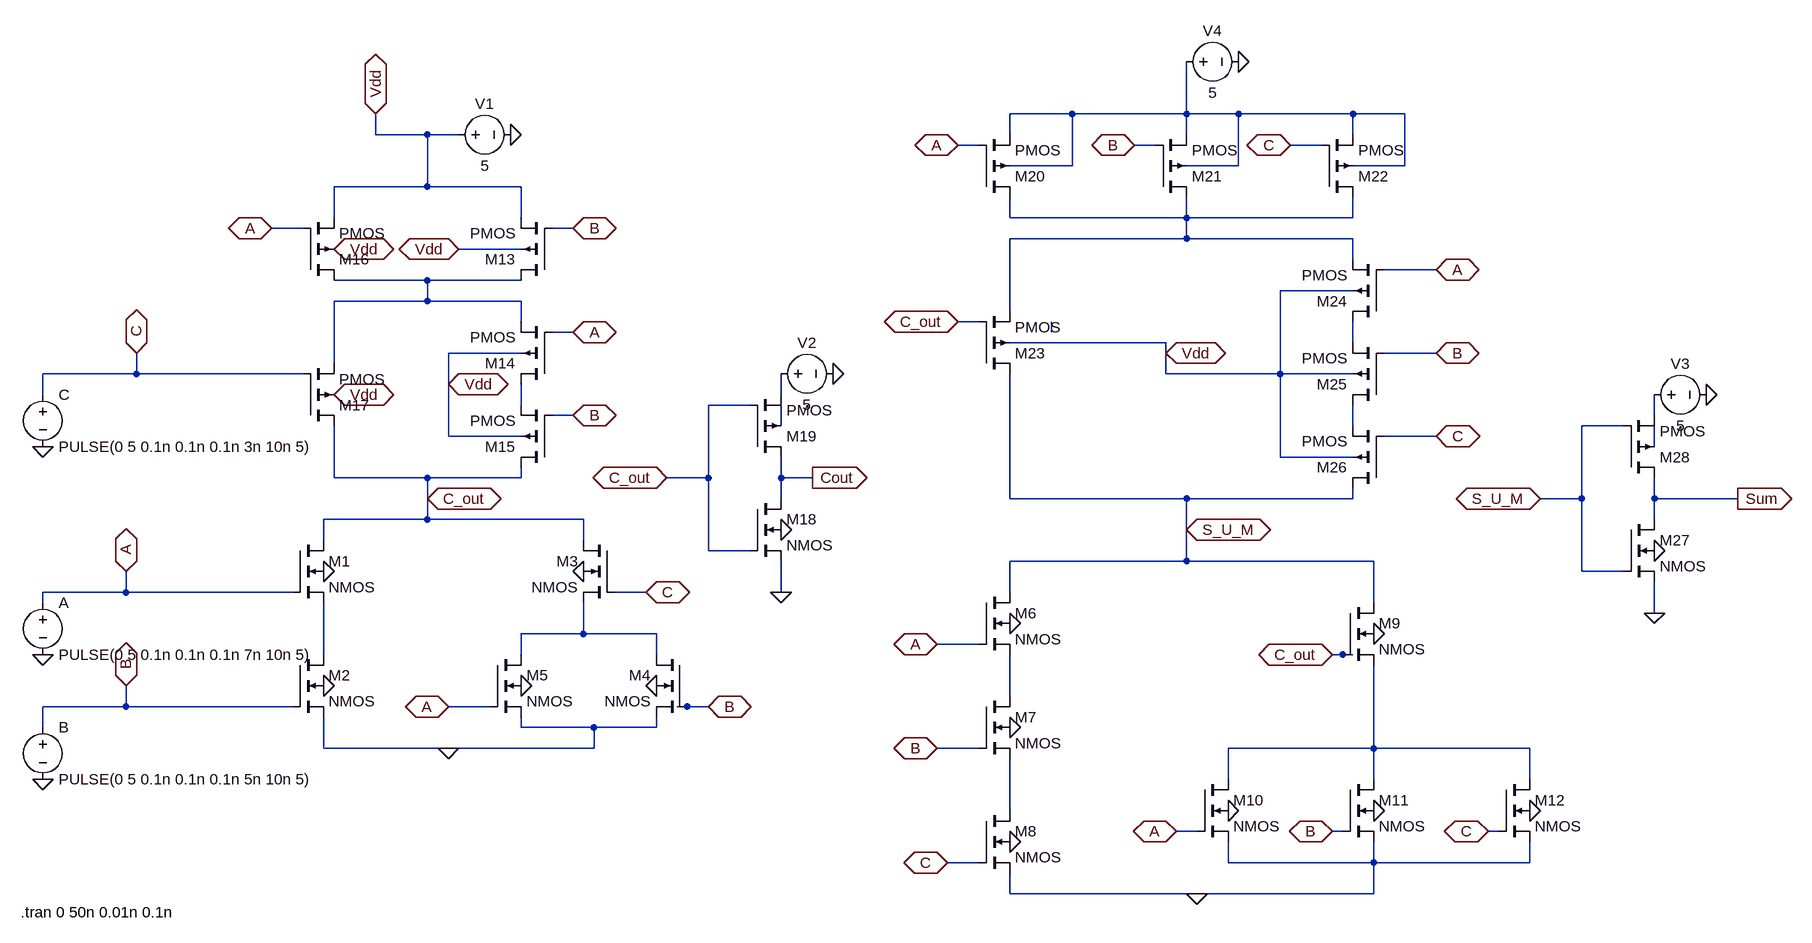
[diagram p0: schematic fulladder.asc]
fulladder.asc, the LTspice schematic file:
Version 4
SHEET 1 880 680
WIRE -2080 -1840 -2176 -1840
WIRE -1904 -1840 -1904 -1920
WIRE -1904 -1840 -2080 -1840
WIRE -1824 -1840 -1904 -1840
WIRE -1648 -1840 -1824 -1840
WIRE -1568 -1840 -1648 -1840
WIRE -3152 -1808 -3152 -1840
WIRE -3072 -1808 -3152 -1808
WIRE -3024 -1808 -3072 -1808
WIRE -2176 -1808 -2176 -1840
WIRE -1904 -1808 -1904 -1840
WIRE -1648 -1808 -1648 -1840
WIRE -2224 -1792 -2256 -1792
WIRE -1952 -1792 -1984 -1792
WIRE -1696 -1792 -1744 -1792
WIRE -2080 -1760 -2080 -1840
WIRE -2080 -1760 -2176 -1760
WIRE -1824 -1760 -1824 -1840
WIRE -1824 -1760 -1904 -1760
WIRE -1568 -1760 -1568 -1840
WIRE -1568 -1760 -1648 -1760
WIRE -3072 -1728 -3072 -1808
WIRE -3072 -1728 -3216 -1728
WIRE -2928 -1728 -3072 -1728
WIRE -3216 -1680 -3216 -1728
WIRE -2928 -1680 -2928 -1728
WIRE -2176 -1680 -2176 -1712
WIRE -1904 -1680 -1904 -1712
WIRE -1904 -1680 -2176 -1680
WIRE -1648 -1680 -1648 -1712
WIRE -1648 -1680 -1904 -1680
WIRE -3264 -1664 -3312 -1664
WIRE -2848 -1664 -2880 -1664
WIRE -1904 -1648 -1904 -1680
WIRE -1904 -1648 -2176 -1648
WIRE -1648 -1648 -1904 -1648
WIRE -2928 -1632 -3024 -1632
WIRE -1648 -1616 -1648 -1648
WIRE -1520 -1600 -1600 -1600
WIRE -3072 -1584 -3216 -1584
WIRE -2928 -1584 -3072 -1584
WIRE -1648 -1568 -1760 -1568
WIRE -3072 -1552 -3072 -1584
WIRE -3072 -1552 -3216 -1552
WIRE -2928 -1552 -3072 -1552
WIRE -2176 -1536 -2176 -1648
WIRE -2928 -1520 -2928 -1552
WIRE -2224 -1520 -2256 -1520
WIRE -2848 -1504 -2880 -1504
WIRE -2112 -1504 -2112 -1520
WIRE -1936 -1488 -2176 -1488
WIRE -1648 -1488 -1648 -1520
WIRE -2928 -1472 -3040 -1472
WIRE -1936 -1472 -1936 -1488
WIRE -1520 -1472 -1600 -1472
WIRE -3216 -1456 -3216 -1552
WIRE -3520 -1440 -3520 -1472
WIRE -3520 -1440 -3664 -1440
WIRE -3264 -1440 -3520 -1440
WIRE -1936 -1440 -1936 -1472
WIRE -1760 -1440 -1760 -1568
WIRE -1760 -1440 -1936 -1440
WIRE -1648 -1440 -1760 -1440
WIRE -3040 -1424 -3040 -1472
WIRE -3664 -1408 -3664 -1440
WIRE -2528 -1408 -2528 -1440
WIRE -2928 -1392 -2928 -1424
WIRE -2576 -1392 -2640 -1392
WIRE -2848 -1376 -2880 -1376
WIRE -1184 -1376 -1184 -1408
WIRE -2528 -1360 -2528 -1392
WIRE -1648 -1360 -1648 -1392
WIRE -1232 -1360 -1296 -1360
WIRE -3040 -1344 -3040 -1424
WIRE -2928 -1344 -3040 -1344
WIRE -1520 -1344 -1600 -1344
WIRE -1184 -1328 -1184 -1360
WIRE -1760 -1312 -1760 -1440
WIRE -1648 -1312 -1760 -1312
WIRE -3216 -1280 -3216 -1360
WIRE -3072 -1280 -3216 -1280
WIRE -2928 -1280 -2928 -1296
WIRE -2928 -1280 -3072 -1280
WIRE -2640 -1280 -2640 -1392
WIRE -2640 -1280 -2704 -1280
WIRE -2528 -1280 -2528 -1312
WIRE -2480 -1280 -2528 -1280
WIRE -3072 -1248 -3072 -1280
WIRE -2528 -1248 -2528 -1280
WIRE -2176 -1248 -2176 -1440
WIRE -1904 -1248 -2176 -1248
WIRE -1648 -1248 -1648 -1264
WIRE -1648 -1248 -1904 -1248
WIRE -1296 -1248 -1296 -1360
WIRE -1296 -1248 -1360 -1248
WIRE -1184 -1248 -1184 -1280
WIRE -1056 -1248 -1184 -1248
WIRE -3072 -1216 -3072 -1248
WIRE -3072 -1216 -3232 -1216
WIRE -2832 -1216 -3072 -1216
WIRE -1184 -1216 -1184 -1248
WIRE -1904 -1200 -1904 -1248
WIRE -3232 -1184 -3232 -1216
WIRE -2832 -1184 -2832 -1216
WIRE -2640 -1168 -2640 -1280
WIRE -2576 -1168 -2640 -1168
WIRE -1904 -1152 -1904 -1200
WIRE -1904 -1152 -2176 -1152
WIRE -1616 -1152 -1904 -1152
WIRE -1296 -1136 -1296 -1248
WIRE -1232 -1136 -1296 -1136
WIRE -3536 -1104 -3536 -1136
WIRE -3536 -1104 -3664 -1104
WIRE -3280 -1104 -3536 -1104
WIRE -2736 -1104 -2784 -1104
WIRE -2528 -1104 -2528 -1152
WIRE -2176 -1104 -2176 -1152
WIRE -3664 -1088 -3664 -1104
WIRE -1616 -1088 -1616 -1152
WIRE -1184 -1072 -1184 -1120
WIRE -2832 -1040 -2832 -1088
WIRE -2832 -1040 -2928 -1040
WIRE -2720 -1040 -2832 -1040
WIRE -2224 -1024 -2288 -1024
WIRE -3232 -1008 -3232 -1088
WIRE -2928 -1008 -2928 -1040
WIRE -2720 -1008 -2720 -1040
WIRE -1664 -1008 -1680 -1008
WIRE -1648 -1008 -1664 -1008
WIRE -2176 -944 -2176 -1008
WIRE -3536 -928 -3536 -960
WIRE -3536 -928 -3664 -928
WIRE -3280 -928 -3536 -928
WIRE -2976 -928 -3040 -928
WIRE -2672 -928 -2688 -928
WIRE -2640 -928 -2672 -928
WIRE -3664 -896 -3664 -928
WIRE -2928 -896 -2928 -912
WIRE -2816 -896 -2928 -896
WIRE -2720 -896 -2720 -912
WIRE -2720 -896 -2816 -896
WIRE -3232 -864 -3232 -912
WIRE -3040 -864 -3232 -864
WIRE -2816 -864 -2816 -896
WIRE -2816 -864 -3040 -864
WIRE -2224 -864 -2288 -864
WIRE -1616 -864 -1616 -992
WIRE -1616 -864 -1840 -864
WIRE -1376 -864 -1616 -864
WIRE -1840 -816 -1840 -864
WIRE -1616 -816 -1616 -864
WIRE -1376 -816 -1376 -864
WIRE -2176 -768 -2176 -848
WIRE -1888 -736 -1920 -736
WIRE -1664 -736 -1680 -736
WIRE -1424 -736 -1440 -736
WIRE -2224 -688 -2272 -688
WIRE -1840 -688 -1840 -720
WIRE -1616 -688 -1616 -720
WIRE -1616 -688 -1840 -688
WIRE -1376 -688 -1376 -720
WIRE -1376 -688 -1616 -688
WIRE -2176 -640 -2176 -672
WIRE -1888 -640 -2176 -640
WIRE -1616 -640 -1616 -688
WIRE -1616 -640 -1888 -640
FLAG -3664 -1328 0
FLAG -3664 -1008 0
FLAG -3664 -816 0
FLAG -3232 -1136 0
FLAG -3232 -960 0
FLAG -2928 -960 0
FLAG -2720 -960 0
FLAG -2832 -1136 0
FLAG -2944 -1808 0
FLAG -3152 -1840 Vdd
IOPIN -3152 -1840 BiDir
FLAG -3216 -1632 Vdd
IOPIN -3216 -1632 BiDir
FLAG -3216 -1408 Vdd
IOPIN -3216 -1408 BiDir
FLAG -3024 -1632 Vdd
IOPIN -3024 -1632 BiDir
FLAG -3040 -1424 Vdd
IOPIN -3040 -1424 BiDir
FLAG -3536 -1136 A
IOPIN -3536 -1136 BiDir
FLAG -3040 -928 A
IOPIN -3040 -928 BiDir
FLAG -2848 -1504 A
IOPIN -2848 -1504 BiDir
FLAG -3312 -1664 A
IOPIN -3312 -1664 BiDir
FLAG -2848 -1376 B
IOPIN -2848 -1376 BiDir
FLAG -2848 -1664 B
IOPIN -2848 -1664 BiDir
FLAG -2736 -1104 C
IOPIN -2736 -1104 BiDir
FLAG -2640 -928 B
IOPIN -2640 -928 BiDir
FLAG -3536 -960 B
IOPIN -3536 -960 BiDir
FLAG -3520 -1472 C
IOPIN -3520 -1472 BiDir
FLAG -1440 -736 C
IOPIN -1440 -736 BiDir
FLAG -1680 -736 B
IOPIN -1680 -736 BiDir
FLAG -1920 -736 A
IOPIN -1920 -736 BiDir
FLAG -2272 -688 C
IOPIN -2272 -688 BiDir
FLAG -2288 -864 B
IOPIN -2288 -864 BiDir
FLAG -2288 -1024 A
IOPIN -2288 -1024 BiDir
FLAG -1680 -1008 C_out
IOPIN -1680 -1008 BiDir
FLAG -3072 -1248 C_out
IOPIN -3072 -1248 BiDir
FLAG -2256 -1520 C_out
IOPIN -2256 -1520 BiDir
FLAG -2176 -1056 0
FLAG -2176 -896 0
FLAG -2176 -720 0
FLAG -1840 -768 0
FLAG -1616 -768 0
FLAG -1376 -768 0
FLAG -1616 -1040 0
FLAG -1888 -640 0
FLAG -2528 -1104 0
FLAG -1936 -1472 Vdd
IOPIN -1936 -1472 BiDir
FLAG -2256 -1792 A
IOPIN -2256 -1792 BiDir
FLAG -1520 -1600 A
IOPIN -1520 -1600 BiDir
FLAG -1520 -1472 B
IOPIN -1520 -1472 BiDir
FLAG -1984 -1792 B
IOPIN -1984 -1792 BiDir
FLAG -1520 -1344 C
IOPIN -1520 -1344 BiDir
FLAG -1744 -1792 C
IOPIN -1744 -1792 BiDir
FLAG -1184 -1072 0
FLAG -2704 -1280 C_out
IOPIN -2704 -1280 BiDir
FLAG -2480 -1280 Cout
IOPIN -2480 -1280 Out
FLAG -1056 -1248 Sum
IOPIN -1056 -1248 Out
FLAG -1904 -1200 S_U_M
IOPIN -1904 -1200 BiDir
FLAG -1360 -1248 S_U_M
IOPIN -1360 -1248 BiDir
FLAG -2528 -1200 0
FLAG -1184 -1168 0
FLAG -2448 -1440 0
FLAG -1104 -1408 0
FLAG -3040 -864 0
FLAG -1824 -1920 0
SYMBOL nmos4 -3280 -1184 R0
SYMATTR InstName M1
SYMBOL nmos4 -3280 -1008 R0
SYMATTR InstName M2
SYMBOL nmos4 -2784 -1184 M0
SYMATTR InstName M3
SYMBOL nmos4 -2672 -1008 M0
SYMATTR InstName M4
SYMBOL nmos4 -2976 -1008 R0
SYMATTR InstName M5
SYMBOL nmos4 -2224 -1104 R0
SYMATTR InstName M6
SYMBOL nmos4 -2224 -944 R0
SYMATTR InstName M7
SYMBOL nmos4 -2224 -768 R0
SYMATTR InstName M8
SYMBOL nmos4 -1664 -1088 R0
SYMATTR InstName M9
SYMBOL nmos4 -1888 -816 R0
SYMATTR InstName M10
SYMBOL nmos4 -1664 -816 R0
SYMATTR InstName M11
SYMBOL nmos4 -1424 -816 R0
SYMATTR InstName M12
SYMBOL pmos4 -2880 -1424 R180
SYMATTR InstName M14
SYMBOL pmos4 -2880 -1296 R180
SYMATTR InstName M15
SYMBOL pmos4 -3264 -1360 M180
SYMATTR InstName M17
SYMBOL pmos4 -2880 -1584 R180
SYMATTR InstName M13
SYMBOL pmos4 -3264 -1584 M180
SYMATTR InstName M16
SYMBOL voltage -3664 -1104 R0
WINDOW 123 0 0 Left 2
WINDOW 39 0 0 Left 2
SYMATTR InstName A
SYMATTR Value PULSE(0 5 0.1n 0.1n 0.1n 7n 10n 5)
SYMBOL voltage -3664 -912 R0
WINDOW 123 0 0 Left 2
WINDOW 39 0 0 Left 2
SYMATTR InstName B
SYMATTR Value PULSE(0 5 0.1n 0.1n 0.1n 5n 10n 5)
SYMBOL voltage -3664 -1424 R0
WINDOW 123 0 0 Left 2
WINDOW 39 0 0 Left 2
SYMATTR InstName C
SYMATTR Value PULSE(0 5 0.1n 0.1n 0.1n 3n 10n 5)
SYMBOL voltage -3040 -1808 M90
WINDOW 0 -32 56 VBottom 2
WINDOW 3 32 56 VTop 2
WINDOW 123 0 0 Left 2
WINDOW 39 0 0 Left 2
SYMATTR InstName V1
SYMATTR Value 5
SYMBOL nmos4 -2576 -1248 R0
SYMATTR InstName M18
SYMBOL pmos4 -2576 -1312 M180
SYMATTR InstName M19
SYMBOL pmos4 -2224 -1712 M180
SYMATTR InstName M20
SYMBOL pmos4 -1952 -1712 M180
SYMATTR InstName M21
SYMBOL pmos4 -1696 -1712 M180
SYMATTR InstName M22
SYMBOL pmos4 -2224 -1440 M180
SYMATTR InstName M23
SYMBOL pmos4 -1600 -1520 R180
SYMATTR InstName M24
SYMBOL pmos4 -1600 -1392 R180
SYMATTR InstName M25
SYMBOL pmos4 -1600 -1264 R180
SYMATTR InstName M26
SYMBOL nmos4 -1232 -1216 R0
SYMATTR InstName M27
SYMBOL pmos4 -1232 -1280 M180
SYMATTR InstName M28
SYMBOL voltage -2544 -1440 M90
WINDOW 0 -32 56 VBottom 2
WINDOW 3 32 56 VTop 2
WINDOW 123 0 0 Left 2
WINDOW 39 0 0 Left 2
SYMATTR InstName V2
SYMATTR Value 5
SYMBOL voltage -1200 -1408 M90
WINDOW 0 -32 56 VBottom 2
WINDOW 3 32 56 VTop 2
WINDOW 123 0 0 Left 2
WINDOW 39 0 0 Left 2
SYMATTR InstName V3
SYMATTR Value 5
SYMBOL voltage -1920 -1920 M90
WINDOW 0 -32 56 VBottom 2
WINDOW 3 32 56 VTop 2
WINDOW 123 0 0 Left 2
WINDOW 39 0 0 Left 2
SYMATTR InstName V4
SYMATTR Value 5
TEXT -3698 -612 Left 2 !.tran 0 50n 0.01n 0.1n

The netlist it stands for:
* fulladder.asc
M1 C_out A N013 0 NMOS
M2 N013 B 0 0 NMOS
M3 C_out C N012 0 NMOS
M4 N012 B 0 0 NMOS
M5 N012 A 0 0 NMOS
M6 S_U_M A N014 0 NMOS
M7 N014 B N016 0 NMOS
M8 N016 C 0 0 NMOS
M9 S_U_M C_out N015 0 NMOS
M10 N015 A 0 0 NMOS
M11 N015 B 0 0 NMOS
M12 N015 C 0 0 NMOS
M14 N007 A N003 Vdd PMOS
M15 C_out B N007 Vdd PMOS
M17 C_out C N003 Vdd PMOS
M13 N003 B Vdd Vdd PMOS
M16 N003 A Vdd Vdd PMOS
V§A A 0 PULSE(0 5 0.1n 0.1n 0.1n 7n 10n 5)
V§B B 0 PULSE(0 5 0.1n 0.1n 0.1n 5n 10n 5)
V§C C 0 PULSE(0 5 0.1n 0.1n 0.1n 3n 10n 5)
V1 Vdd 0 5
M18 Cout C_out 0 0 NMOS
M19 Cout C_out N006 N009 PMOS
M20 N002 A N001 N001 PMOS
M21 N002 B N001 N001 PMOS
M22 N002 C N001 N001 PMOS
M23 S_U_M C_out N002 Vdd PMOS
M24 N005 A N002 Vdd PMOS
M25 N010 B N005 Vdd PMOS
M26 S_U_M C N010 Vdd PMOS
M27 Sum S_U_M 0 0 NMOS
M28 Sum S_U_M N008 N011 PMOS
V2 N006 0 5
V3 N008 0 5
V4 N001 0 5
.model NMOS NMOS
.model PMOS PMOS
.lib standard.mos
.tran 0 50n 0.01n 0.1n
.backanno
.end

* Results of the author's LTspice run, read from the files saved beside the schematic
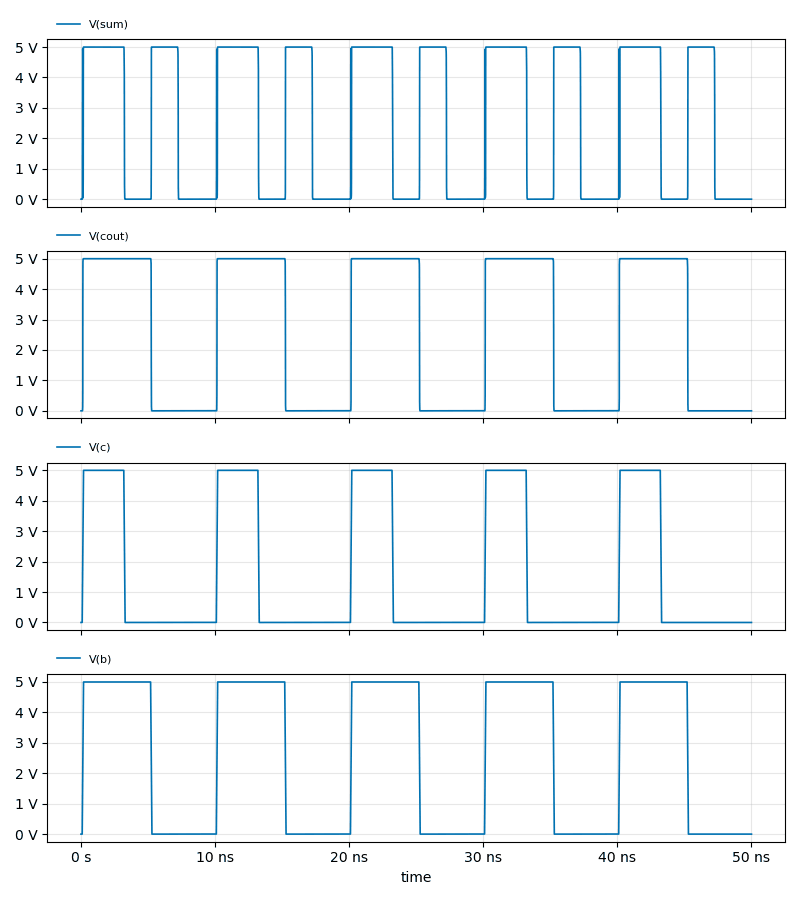
[diagram p1: Transient Analysis of fulladder.asc, plotted from the saved traces]
* Transient Analysis, 1 run:
*   V(sum): min 0 V, max 5 V, average 2.551 V, rms 3.567 V, last 0 V
*   V(cout): min 0 V, max 5 V, average 2.552 V, rms 3.571 V, last 0 V
*   V(c): min 0 V, max 5 V, average 1.55 V, rms 2.769 V, last 0 V
*   V(b): min 0 V, max 5 V, average 2.551 V, rms 3.559 V, last 0 V